# Altium schematic sheet 04. MCU + ANALOG.SchDoc
size A3
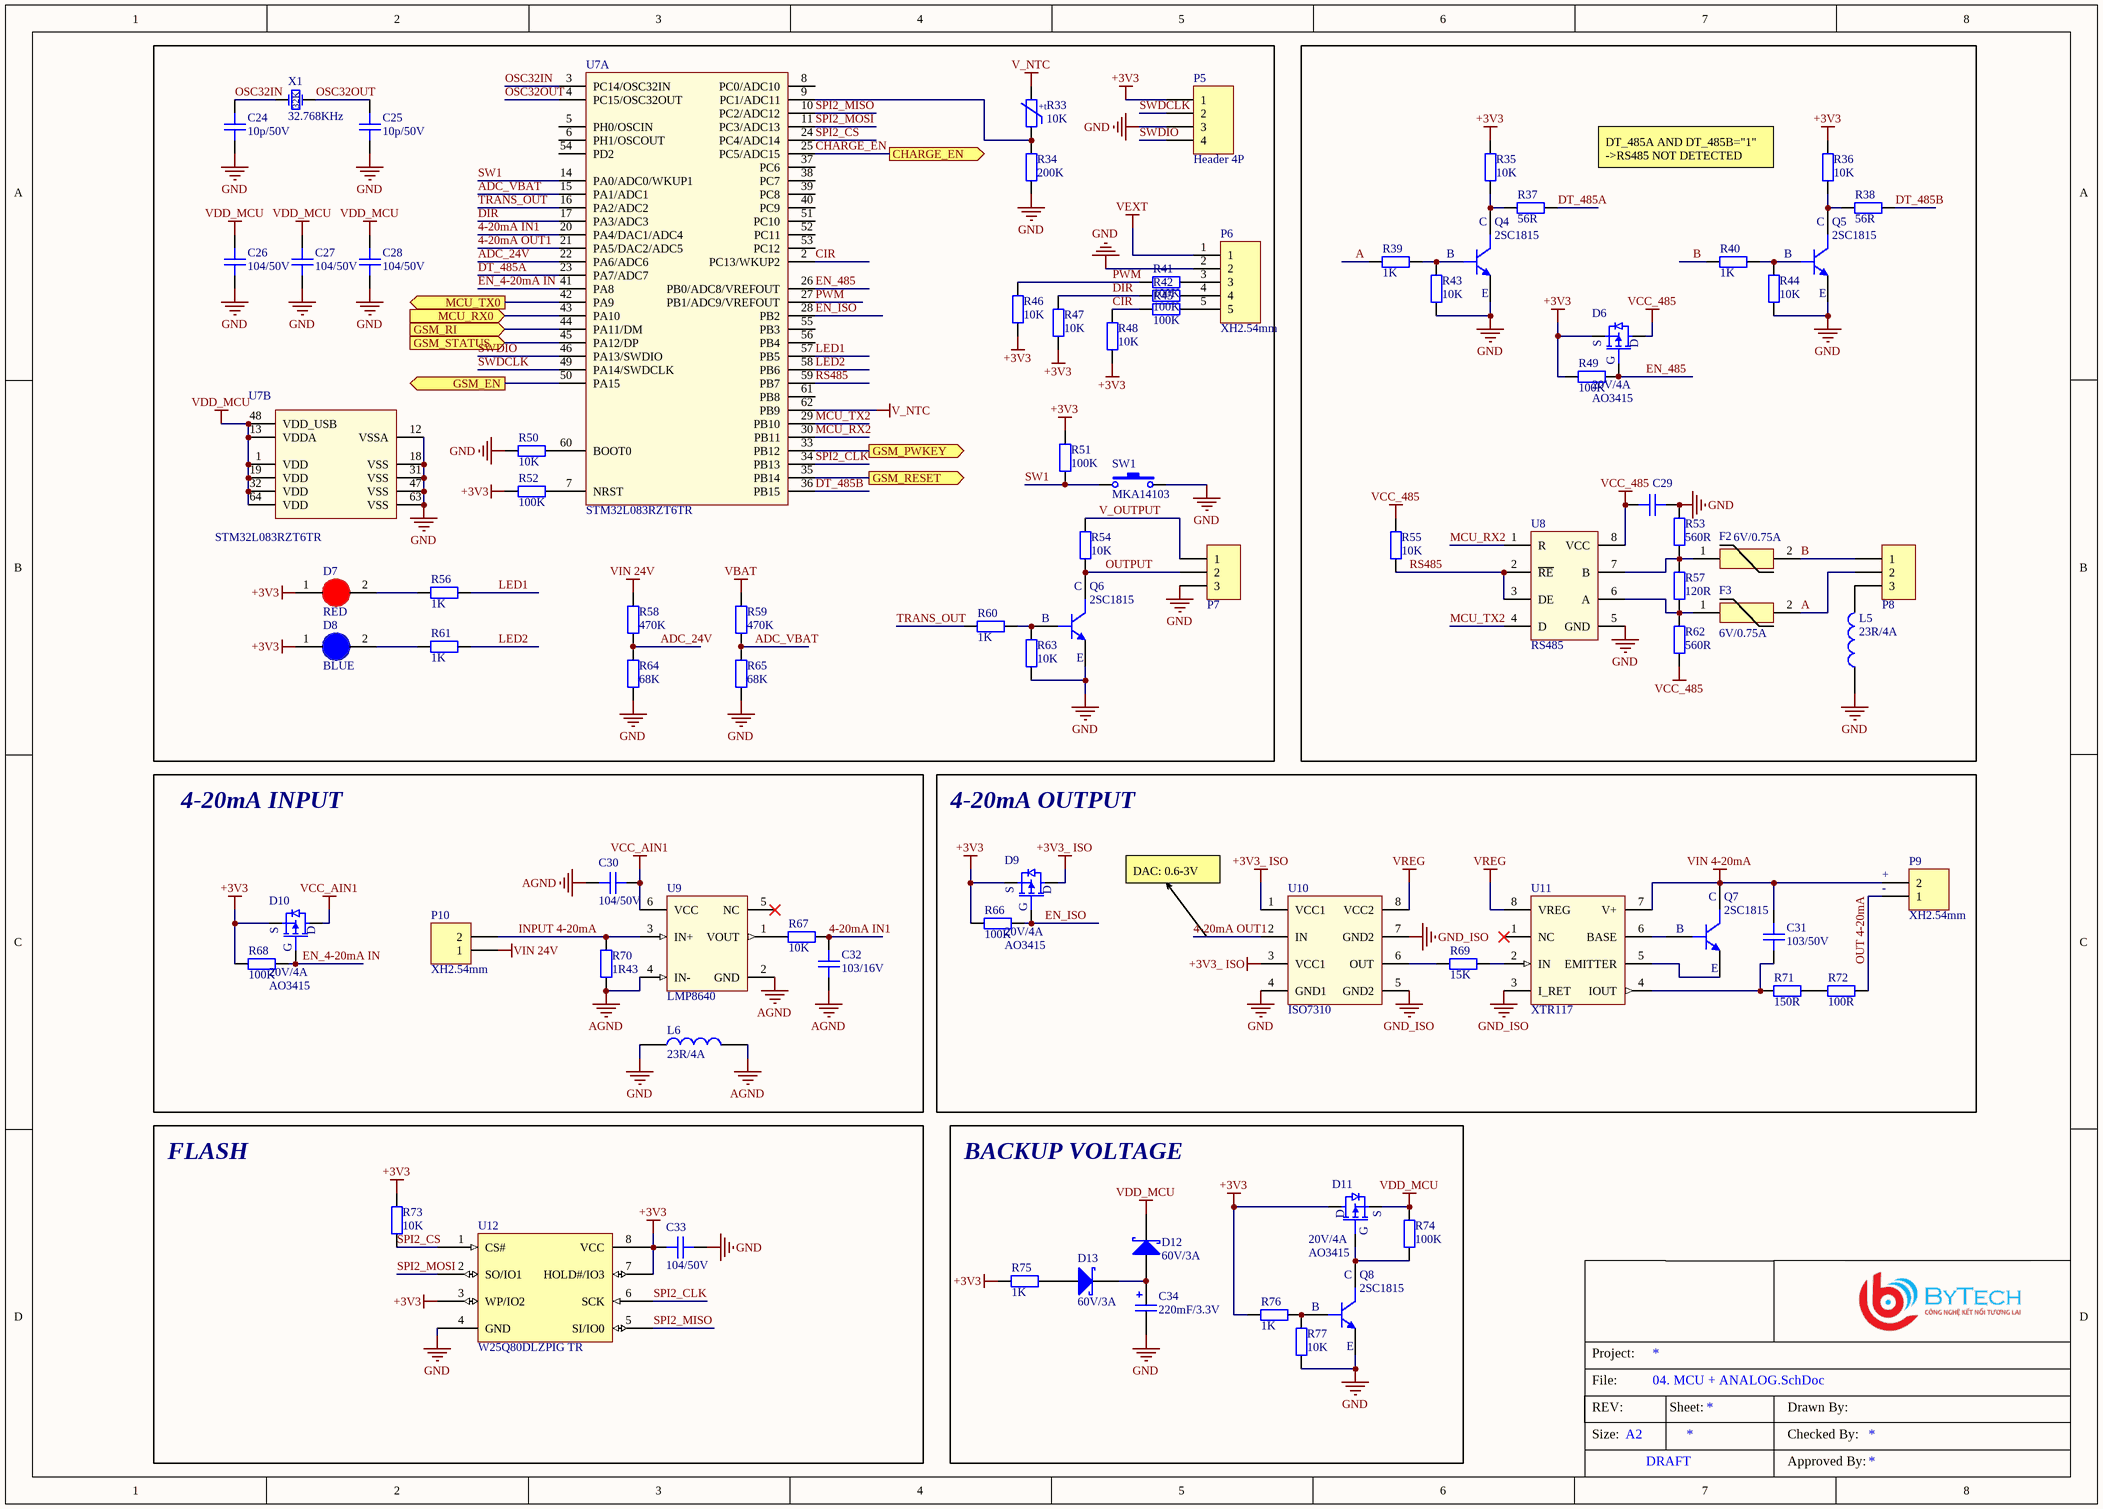
[diagram p0: 04. MCU + ANALOG.SchDoc]

## Parts
C24  10p/50V  [CAPC-0603 (1608)]
C25  10p/50V  [CAPC-0603 (1608)]
C26  104/50V  [CAPC-0603 (1608)]
C27  104/50V  [CAPC-0603 (1608)]
C28  104/50V  [CAPC-0603 (1608)]
C29  104/50V  [CAPC-0603 (1608)]  (value not drawn)
C30  104/50V  [CAPC-0603 (1608)]
C31  103/50V  [CAPC-0805 (2012)]
C32  103/16V  [CAPC-0603 (1608)]
C33  104/50V  [CAPC-0603 (1608)]
C34  220mF/3.3V  [CAP-SUPER-0.22F]
D6  20V/4A  [SOT23_3]
D7  RED  [LED 0603]
D8  BLUE  [LED 0603]
D9  20V/4A  [SOT23_3]
D10  20V/4A  [SOT23_3]
D11  20V/4A  [SOT23_3]
D12  60V/3A  [DIODE_DO214AC_SMA]
D13  60V/3A  [DIODE_DO214AC_SMA]
F2  6V/0.75A  [FUSE 0ZCK_BEL]
F3  6V/0.75A  [FUSE 0ZCK_BEL]
L5  23R/4A  [IND-0603 (1608)]
L6  23R/4A  [IND-0603 (1608)]
P5  Header 4P  [HDR1X4]
P6  XH2.54mm  [XH2.54-5P]
P7  RS485  [XH2.54-3P]  (value not drawn)
P8  RS485  [XH2.54-3P]  (value not drawn)
P9  XH2.54mm  [XH2.54-2P]
P10  XH2.54mm  [XH2.54-2P]
Q4  2SC1815  [SOT23_3]
Q5  2SC1815  [SOT23_3]
Q6  2SC1815  [SOT23_3]
Q7  2SC1815  [SOT23_3]
Q8  2SC1815  [SOT23_3]
R33  10K  [RES NTC 10K]
R34  200K  [RESC-0603 (1608)]
R35  10K  [RESC-0603 (1608)]
R36  10K  [RESC-0603 (1608)]
R37  56R  [RESC-0603 (1608)]
R38  56R  [RESC-0603 (1608)]
R39  1K  [RESC-0603 (1608)]
R40  1K  [RESC-0603 (1608)]
R41  100K  [RESC-0603 (1608)]
R42  100K  [RESC-0603 (1608)]
R43  10K  [RESC-0603 (1608)]
R44  10K  [RESC-0603 (1608)]
R45  100K  [RESC-0603 (1608)]
R46  10K  [RESC-0603 (1608)]
R47  10K  [RESC-0603 (1608)]
R48  10K  [RESC-0603 (1608)]
R49  100K  [RESC-0603 (1608)]
R50  10K  [RESC-0603 (1608)]
R51  100K  [RESC-0603 (1608)]
R52  100K  [RESC-0603 (1608)]
R53  560R  [RESC-0603 (1608)]
R54  10K  [RESC-0603 (1608)]
R55  10K  [RESC-0603 (1608)]
R56  1K  [RESC-0603 (1608)]
R57  120R  [RESC-0603 (1608)]
R58  470K  [RESC-0603 (1608)]
R59  470K  [RESC-0603 (1608)]
R60  1K  [RESC-0603 (1608)]
R61  1K  [RESC-0603 (1608)]
R62  560R  [RESC-0603 (1608)]
R63  10K  [RESC-0603 (1608)]
R64  68K  [RESC-0603 (1608)]
R65  68K  [RESC-0603 (1608)]
R66  100K  [RESC-0603 (1608)]
R67  10K  [RESC-0603 (1608)]
R68  100K  [RESC-0603 (1608)]
R69  15K  [RESC-0603 (1608)]
R70  1R43  [RESC-0603 (1608)]
R71  150R  [RESC-0603 (1608)]
R72  100R  [RESC-0603 (1608)]
R73  10K  [RESC-0603 (1608)]
R74  100K  [RESC-0603 (1608)]
R75  1K  [RESC-0603 (1608)]
R76  1K  [RESC-0603 (1608)]
R77  10K  [RESC-0603 (1608)]
SW1  MKA14103  [MKA-14103]
U7  STM32L083RZT6TR  [LQFP-64]  (parts A,B of 2)
U8  RS485  [SOIC8]
U9  LMP8640  [SOT23-6]
U10  ISO7310  [SOIC-8]
U11  XTR117  [8VSSOP]
U12  W25Q80DLZPIG TR  [WSON-8 6X5MM]
X1  32.768KHz  [CRYSTAL_ABS06 2x1.2mm]

## Blocks framed on the sheet
4-20mA INPUT: C30 C32 D10 L6 P10 R67 R68 R70 U9
4-20mA OUTPUT: C31 D9 P9 Q7 R66 R69 R71 R72 U10 U11
FLASH: C33 R73 U12
BACKUP VOLTAGE: C34 D11-D13 Q8 R74-R77

## Ports
CHARGE_EN (out), GSM_EN (out), GSM_PWKEY (out), GSM_RESET (out), GSM_RI (in), GSM_STATUS (in), MCU_RX0 (in), MCU_TX0 (out)

## Nets
+3V3: C33.2 D6.2(S) D7.1(A) D8.1(A) D9.2(S) D10.2(S) D11.3(D) P5.1 R35.2 R36.2 R46.1 R47.1 R48.1 R49.2 R51.2 R52.1 R66.2 R68.2 R73.1 R75.2 R76.1 U12.3(WP/IO2) U12.7(HOLD#/IO3) U12.8(VCC)
+3V3_ ISO: D9.3(D) U10.1(VCC1) U10.3(VCC1)
AGND: C30.2 C32.1 L6.2 R70.1 U9.2(GND) U9.4(IN-)
GND: C24.1 C25.1 C26.1 C27.1 C28.1 C29.1 C33.1 C34.2 L5.1 L6.1 P5.3 P6.2 P7.3 Q4.2(E) Q5.2(E) Q6.2(E) Q8.2(E) R34.1 R43.1 R44.1 R50.2 R53.2 R63.1 R64.1 R65.1 R77.1 SW1.2 U7.12(VSSA) U7.18(VSS) U7.31(VSS) U7.47(VSS) U7.63(VSS) U8.5(GND) U10.4(GND1) U12.4(GND)
GND_ISO: U10.5(GND2) U10.7(GND2) U11.3(I_RET)
V_NTC: R33.2 U7.62(PB9)
VBAT: R59.2
VCC_485: C29.2 D6.3(D) R55.2 R62.1 U8.8(VCC)
VCC_AIN1: C30.1 D10.3(D) U9.6(VCC)
VDD_MCU: C26.2 C27.2 C28.2 D11.2(S) D12.2(K) R74.1 U7.1(VDD) U7.13(VDDA) U7.19(VDD) U7.32(VDD) U7.48(VDD_USB) U7.64(VDD)
VEXT: P6.1
VIN 4-20mA: C31.2 P9.2 Q7.3(C) U11.7(V+)
VIN 24V: P10.1 R58.2
VREG: U10.8(VCC2) U11.8(VREG)
4-20mA IN1: C32.2 R67.1 U7.20(PA4/DAC1/ADC4)
4-20mA OUT1: U7.21(PA5/DAC2/ADC5) U10.2(IN)
A: F3.2 P8.2 R39.1
ADC_24V: R58.1 R64.2 U7.22(PA6/ADC6)
ADC_VBAT: R59.1 R65.2 U7.15(PA1/ADC1)
B: F2.2 P8.1 R40.1
CHARGE_EN: U7.25(PC5/ADC15) ; port CHARGE_EN
CIR: R45.1 R48.2 U7.2(PC13/WKUP2)
DIR: R42.1 R47.2 U7.17(PA3/ADC3)
DT_485A: R37.2 U7.23(PA7/ADC7)
DT_485B: R38.2 U7.36(PB15)
EN_4-20mA IN: D10.1(G) R68.1 U7.41(PA8)
EN_485: D6.1(G) R49.1 U7.26(PB0/ADC8/VREFOUT)
EN_ISO: D9.1(G) R66.1 U7.28(PB2)
GSM_EN: U7.50(PA15) ; port GSM_EN
GSM_PWKEY: U7.33(PB12) ; port GSM_PWKEY
GSM_RESET: U7.35(PB14) ; port GSM_RESET
GSM_RI: U7.44(PA11/DM) ; port GSM_RI
GSM_STATUS: U7.45(PA12/DP) ; port GSM_STATUS
INPUT 4-20mA: P10.2 R70.2 U9.3(IN+)
LED1: R56.2 U7.57(PB5)
LED2: R61.2 U7.58(PB6)
MCU_RX0: U7.43(PA10) ; port MCU_RX0
MCU_RX2: U7.30(PB11) U8.1(R)
MCU_TX0: U7.42(PA9) ; port MCU_TX0
MCU_TX2: U7.29(PB10) U8.4(D)
OSC32IN: C24.2 U7.3(PC14/OSC32IN) X1.1(OSC1)
OSC32OUT: C25.2 U7.4(PC15/OSC32OUT) X1.2(OSC2)
OUT 4-20mA: P9.1 R72.2
OUTPUT: P7.2 Q6.3(C) R54.1
PWM: R41.1 R46.2 U7.27(PB1/ADC9/VREFOUT)
RS485: R55.1 U7.59(PB7) U8.2(~{RE}) U8.3(DE)
SPI2_CLK: U7.34(PB13) U12.6(SCK)
SPI2_CS: R73.2 U7.24(PC4/ADC14) U12.1(CS#)
SPI2_MISO: U7.10(PC2/ADC12) U12.5(SI/IO0)
SPI2_MOSI: U7.11(PC3/ADC13) U12.2(SO/IO1)
SW1: R51.1 SW1.1 U7.14(PA0/ADC0/WKUP1)
SWDCLK: P5.2 U7.49(PA14/SWDCLK)
SWDIO: P5.4 U7.46(PA13/SWDIO)
TRANS_OUT: R60.1 U7.16(PA2/ADC2)
V_OUTPUT: P7.1 R54.2
NetC31_1: C31.1 R71.1 U11.4(IOUT)
NetC34_1: C34.1 D12.1(A) D13.2(K)
NetD7_2: D7.2(K) R56.1
NetD8_2: D8.2(K) R61.1
NetD11_1: D11.1(G) Q8.3(C) R74.2
NetD13_1: D13.1(A) R75.1
NetF2_1: F2.1 R53.1 R57.2 U8.7(B)
NetF3_1: F3.1 R57.1 R62.2 U8.6(A)
NetL5_2: L5.2 P8.3
NetP6_3: P6.3 R41.2
NetP6_4: P6.4 R42.2
NetP6_5: P6.5 R45.2
NetQ4_1: Q4.1(B) R39.2 R43.2
NetQ4_3: Q4.3(C) R35.1 R37.1
NetQ5_1: Q5.1(B) R40.2 R44.2
NetQ5_3: Q5.3(C) R36.1 R38.1
NetQ6_1: Q6.1(B) R60.2 R63.2
NetQ7_1: Q7.1(B) U11.6(BASE)
NetQ7_2: Q7.2(E) U11.5(EMITTER)
NetQ8_1: Q8.1(B) R76.2 R77.2
NetR33_1: R33.1 R34.2 U7.9(PC1/ADC11)
NetR50_1: R50.1 U7.60(BOOT0)
NetR52_2: R52.2 U7.7(NRST)
NetR67_2: R67.2 U9.1(VOUT)
NetR69_1: R69.1 U10.6(OUT)
NetR69_2: R69.2 U11.2(IN)
NetR71_2: R71.2 R72.1

Not connected (* = marked no-connect by the designer): U7 5(PH0/OSCIN) 6(PH1/OSCOUT) 8(PC0/ADC10) 37(PC6) 38(PC7) 39(PC8) 40(PC9) 51(PC10) 52(PC11) 53(PC12) 54(PD2) 55(PB3) 56(PB4) 61(PB8); U9 5(NC)*; U11 1(NC)*

## Notes on the sheet
- DT_485A AND DT_485B="1"
  ->RS485 NOT DETECTED
- DAC: 0.6-3V
- (near P9) +
- (near P9) -
- File:
- Project:
- REV:
- Size:
- A2
- Sheet:
- Drawn By:
- Checked By:
- DRAFT
- Approved By:
- (in symbol 01M1002JF) +t
- (in symbol ABS06-107-32.768kHz-T) 32K

## Library data of the parts
C24 C25 = CL10C100JB8NNND: CAP CER 10pF 5% 50V NP0 0603; Solder: SMT; Company ID: VT00076; Value: 10p/50V; MPN: CL10C100JB8NNND
C26-C30 C33 = C0603C104K5RACTU: CAP CER 0.1uF 50V 10% X7R 0603; Solder: SMT; Company ID: VT00574; MPN: C0603C104K5RACTU; Value: 104/50V
C31 = CL21B103KBANNNC: CAP CER 10nF 10% 50V X7R 0805; Solder: SMT; Value: 103/50V; MPN: CL21B103KBANNNC
C32 = CC0603KRX7R7BB103: CAP CER 10nF 16V 10% X7R 0603; Solder: SMT; Company ID: VT00031; MPN: CC0603KRX7R7BB103; Value: 103/16V
C34 = DCK-3R3E224U-E: CAP 220mF SUPER -20% +80% 3.3V SMD; Solder: HAND; Company ID: VT00087; MPN: DCK-3R3E224U-E; value: 220mF/3.3V
D6 D9-D11 = AO3415: MOSFET P-CH 20V 4A SOT23; MFR: Alpha & Omega Semiconductor Inc.; Company ID: VT00490; CATEGORY: DIODE; SOLDER: SOT23; VALUE: 20V/4A; MPN: AO3415
D7 = LED 0603 RED: Solder: 0603; Company ID: VT00361; MPN: LED 0603 RED; Category: LED Diode; Value: RED
D8 = LED 0603 BLUE: Solder: 0603; Company ID: VT00356; MPN: LED 0603 BLUE; Category: LED Diode; Value: BLUE
D12 D13 = SK36A-LTP: DIODE SCHOTTKY 60V 3A DO214AC; MPN: SK36A-LTP; Category: Diode; Solder: DO214AC; Value: 60V/3A
F2 F3 = 0ZCK0075FF2E: PTC RESET FUSE 6V 750MA 0805; Manufacturer: Bel Fuse Inc.; Solder: SMT; MPN: 0ZCK0075FF2E; Category: Fuse; Value: 6V/0.75A
L5 L6 = FBMJ1608HM230NT: IND-FERRITE BEAD 23 OHM  4A 0603 1LN; Solder: SMT; Company ID: VT00326; MPN: FBMJ1608HM230NT; Value: 23R/4A
P5 = Header 4x1: Header, 4 Pin Pitch 2.54mm; MPN: S1012EC-40-ND; Company ID: VT-00125; Solder: WAVE; Value: Header 4P
P6 = XH2.54-5P: XH2.54mmm - 5P 180 degree; MFR: CHINA; MPN: XH2.54-5P; Value: XH2.54mm
P7 P8 = Header XH2.54 - 3P: Header XH2.54mm 3P; MPN: CLA1879; MFR: China Brand; Solder: Wave; Category: Connector; Value: 3P
P9 P10 = XH-2A: XH2.54mmm - 2P 180 degree; MPN: XH-2A; Value: XH2.54mm
Q4-Q8 = 2SC1815: TRANS NPN 50V 0.15A SOT23-3; Solder: SMT; Company ID: VT00492; MPN: 2SC1815; Value: 2SC1815; Category: Transistor
R33 = 01M1002JF: THERMISTOR NTC 10KOHM 3964K BEAD; MFR: Vishay; Solder: Wave; MPN: 01M1002JF; Value: 10K; Category: RESISTOR
R34 = CR0603-FX-2003ELF: RES SMD 200K OHM 1% 1/10W 0603; MPN: CR0603-FX-2003ELF; VALUE: 200K; Category: Resistor
R35 R36 R43 R44 R46-R48 R50 R54 R55 R63 R67 R73 R77 = RC0603FR-0710KL: RES SMD 10K OHM 1% 1/10W 0603; Solder: SMT; Company ID: VT00426; MPN: RC0603FR-0710KL; Value: 10K
R37 R38 = RC0603JR-0756RL: RES SMD 56 OHM 5% 1/10W 0603; Solder: SMT; Value: 56R; MPN: RC0603JR-0756RL
R39 R40 R56 R60 R61 R75 R76 = RC0603FR-071KL: RES SMD 1 KOHM 1% 1/10W 0603; Solder: SMT; Company ID: VT00433; MPN: RC0603FR-071KL; Value: 1K
R41 R42 R45 R49 R51 R52 R66 R68 R74 = RC0603FR-07100KL: RES SMD 100K OHM 1% 1/10W 0603; Solder: SMT; Company ID: VT00424; MPN: RC0603FR-07100KL; Value: 100K
R53 R62 = RC0603FR-07560RL: RES SMD 560 OHM 1% 1/10W 0603; Solder: SMT; Company ID: VT00455; MPN: RC0603FR-07560RL; Value: 560R
R57 = RC0603FR-07120RL: RES SMD 120 OHM 1% 1/10W 0603; Solder: SMT; Company ID: VT00427; MPN: RC0603FR-07120RL; Value: 120R
R58 R59 = RC0603FR-07470KL: RES SMD 470K OHM 1% 1/10W 0603; Solder: SMT; Company ID: VT00448; Value: 470K; MPN: RC0603FR-07470K
R64 R65 = CRCW060368K0FKEA: RES SMD 68K OHM 1% 1/10W 0603; Solder: SMT; MPN: CRCW060368K0FKEA; Value: 68K
R69 = RT0603BRE-0715KL: RES SMD 15K OHM 0.1% 1/10W 0603; Value: 15K; MPN: RT0603BRE-0715KL; CATEGORY: RESISTOR; SOLDER: RES-0603; COMPANY ID: *
R70 = RT0603BRE071R43L: RES SMD 1.43 OHM 0.1% 1/10W 0603; MFR: YAGEO; MPN: RT0603BRE071R43L; CATEGORY: RESISTOR; SOLDE: RES-0603; Value: 1R43; COMPANY ID: *
R71 = RC0603FR-07150RP: RES SMD 150 OHM 1% 1/10W 0603; MFR: YAGEO; MPN: RC0603FR-07150RP; CATEGORY: RESISTOR; SOLDER: RES-0603; Value: 150R; COMPANY ID: *
R72 = RC0603FR-07100RL: RES SMD 100 OHM 1% 1/10W 0603; Solder: SMT; Company ID: VT00425; MPN: RC0603FR-07100RL; Value: 100R
SW1 = MKA14103: switch magnetic control switch 14103 2*14MM; MFR: CHINA; SOLDER: WAVE; MPN: MKA14103; CATEGORY: SW; Value: MKA14103
U7 = STM32L083RZT6TR: IC MCU 32BIT 192KB FLASH 64LQFP; MFR: ST; MPN: STM32L083RZT6TR; CATEGORY: IC; SOLDER: 64 LQFP; Value: STM32L083RZT6TR; COMPANY ID: *
U8 = SN65HVD72DR: IC TRANSCEIVER HALF 1/1 8SOIC; MFR: TI; SOLDER: SOIC-8; MPN: SN65HVD72DR; CATEGORY: IC; VALUE: RS485
U9 = LMP8640MK-H/NOPB: IC CURR SENSE 1 CIRCUIT TSOT23-6; MFR: TI; MPN: LMP8640MK-H/NOPB; CATEGORY: IC; SOLDER: SOT23-6; Value: LMP8640; COMPANY ID: *
U10 = ISO7310CQDRQ1: DGTL ISO 3000VRMS 1CH 8SOIC; MFR: TI; MPN: ISO7310CQDRQ1; SOLDER: SOIC-8; CATEGORY: IC; Value: ISO7310; COMPANY ID: *
U11 = XTR117AIDGKR: IC CURRENT TRANSMITTER 8VSSOP; MFR: Texas Instruments; MPN: XTR117AIDGKR; CATEGORY: IC; SOLDER: 8VSSOP; Value: XTR117; Company ID: *
U12 = W25Q80DLZPIG TR: IC FLSH 8MBIT SPI/QUAD I/O 8WSON; MFR: Winbond Electronics; Solder: SMT; MPN: W25Q80DLZPIG TR; Value: W25Q80DLZPIG TR; Category: IC; Company ID: *
X1 = ABS06-107-32.768kHz-T: CRYSTAL 32.7680KHZ 4pF SMD; Solder: SMT; Company ID: VT00159; Value: 32.768KHz; MPN: ABS06-107-32.768kHz-T